# EasyEDA Pro project esp32_phiccamdien.eprj

# Schematic Schematic1
Board Name: Board1; Create Date: 2025-09-16; Page Name: P1; Project Name: esp32_phiccamdien; Schematic Name: Schematic1; Update Date: 2025-10-02; Company: EasyEDA.com; Page Size: A4; Version: V1.0
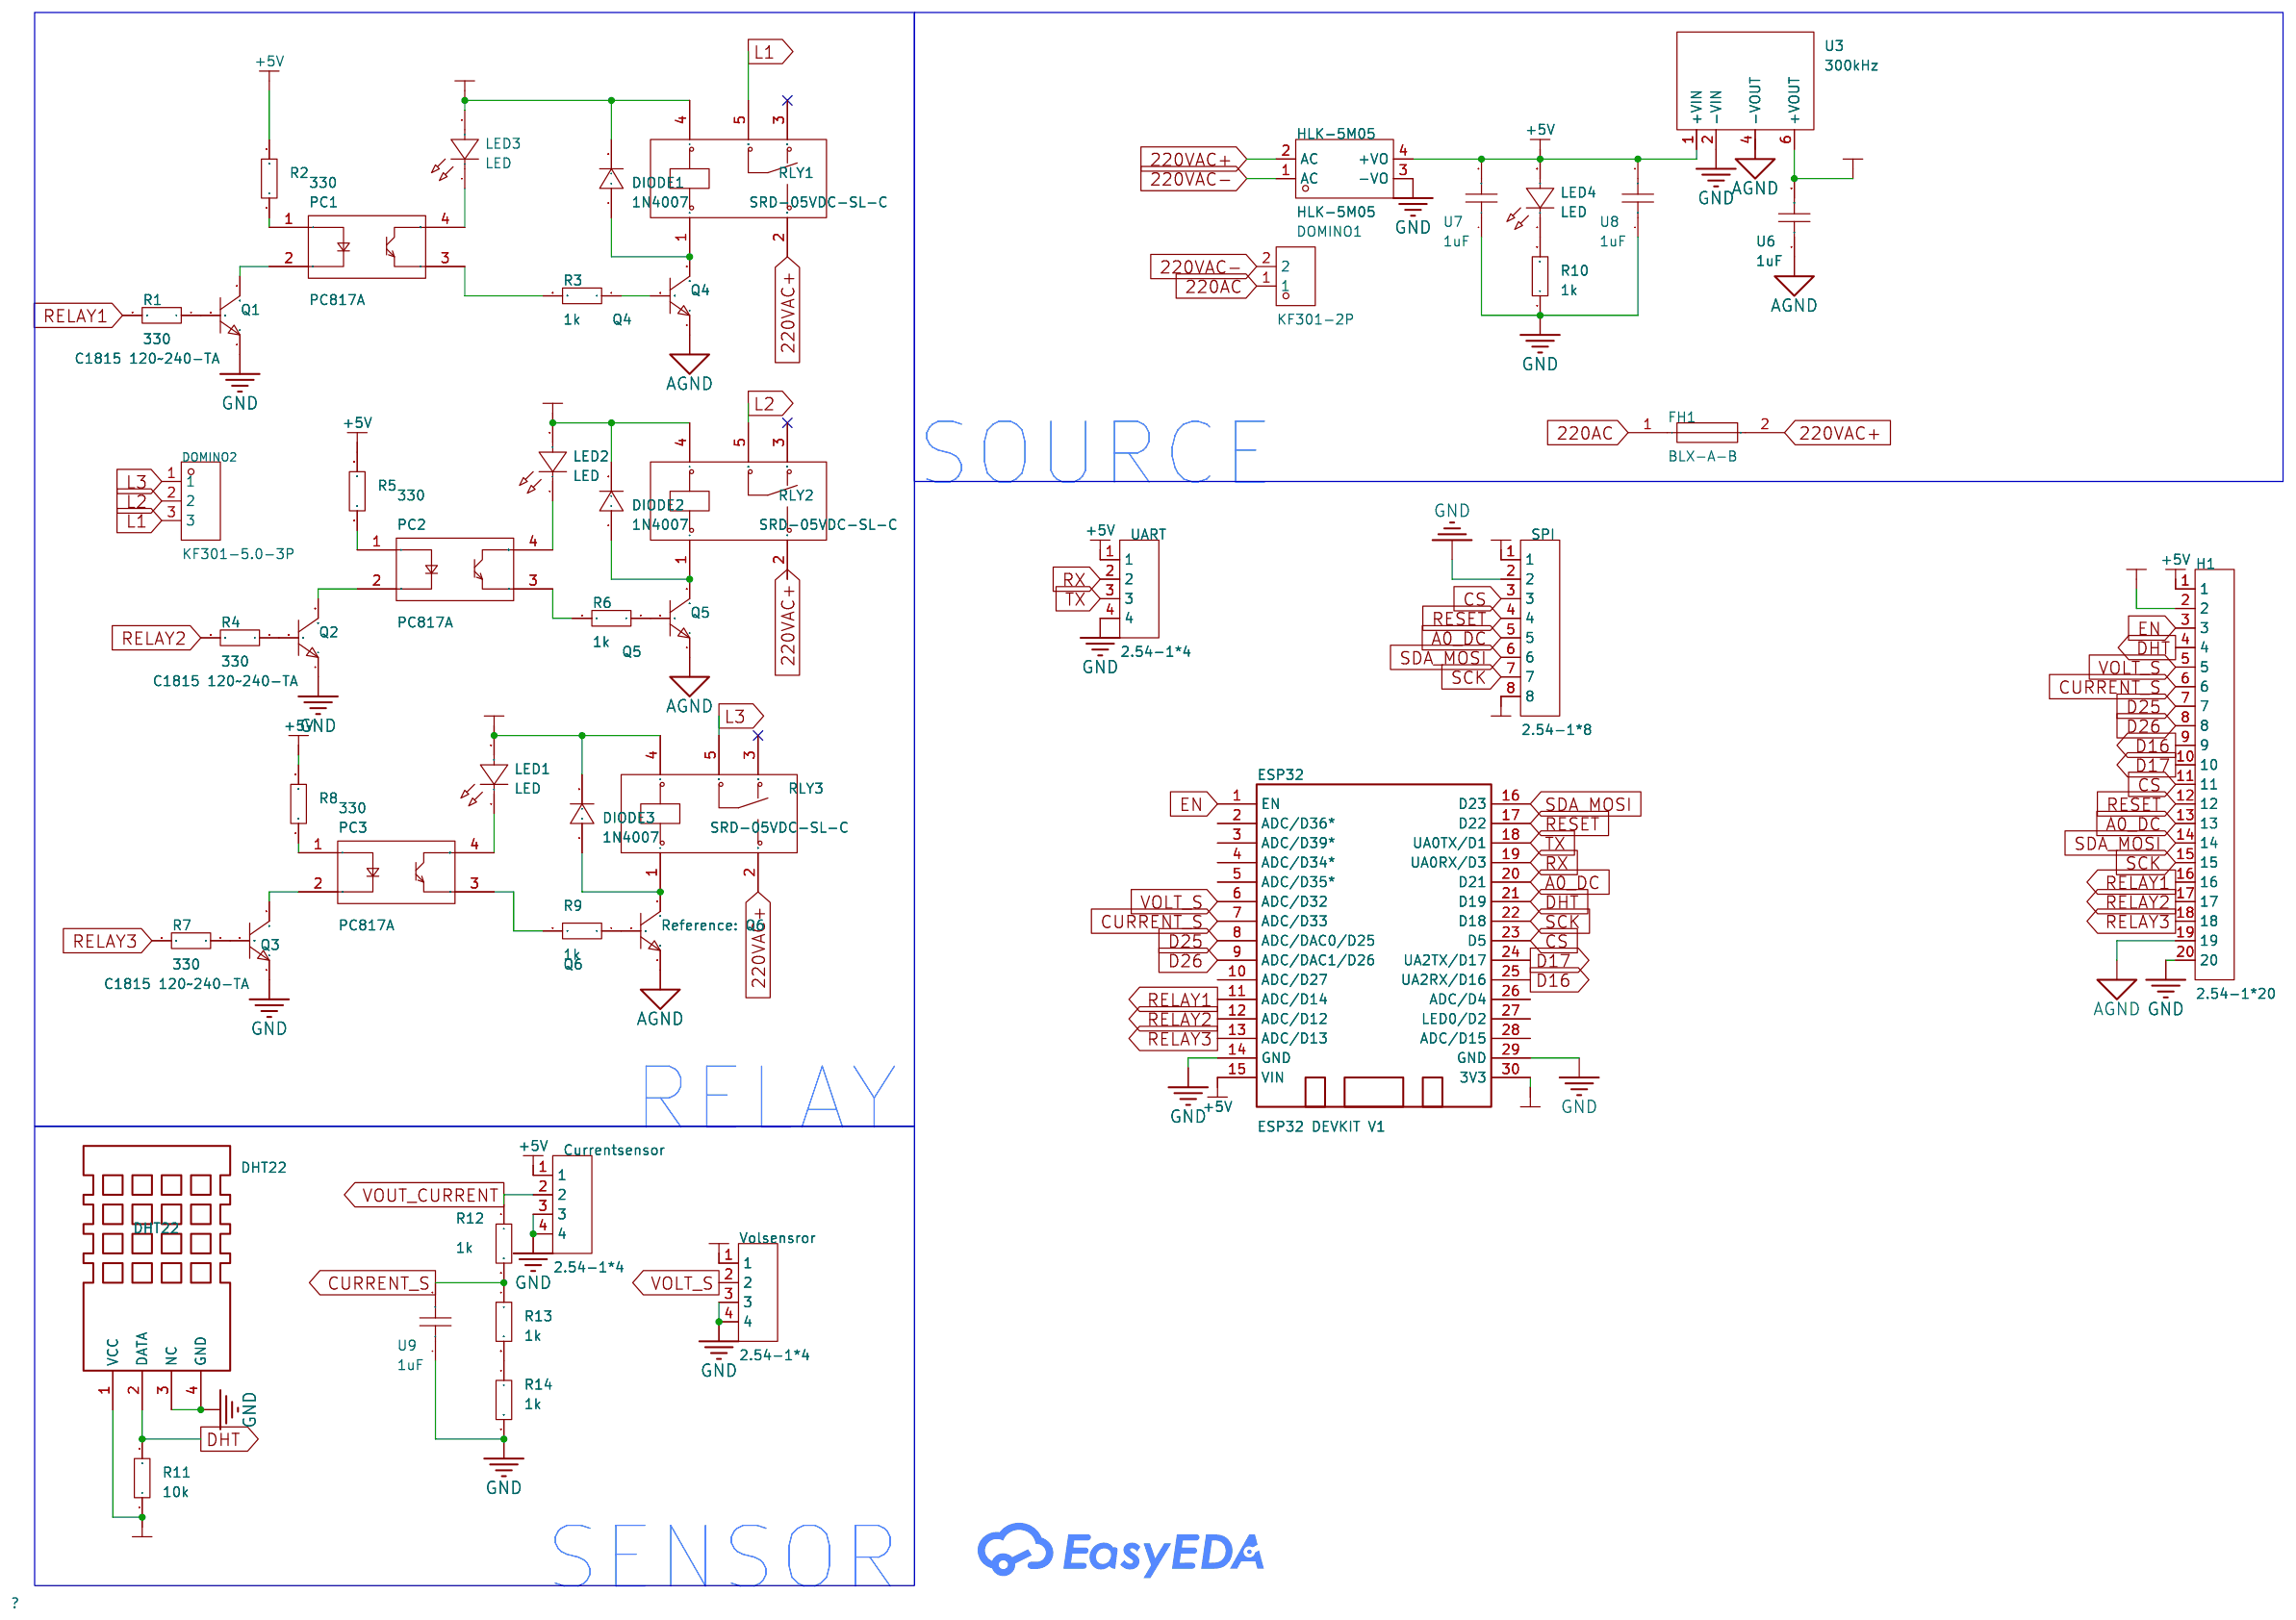
[diagram p0: schematic sheet]

## Parts
Currentsensor  2.54-1*4  [HDR-TH_4P-P2.54-V-M-1]
DHT22  DHT22  [DHT22_AM2303_VERT]
DIODE1  1N4007  [DO-41_BD2.4-L4.7-P8.70-D0.9-FD]
DIODE2  1N4007  [DO-41_BD2.4-L4.7-P8.70-D0.9-FD]
DIODE3  1N4007  [DO-41_BD2.4-L4.7-P8.70-D0.9-FD]
DOMINO1  KF301-2P  [CONN-TH_XY301V-A-5.0-2P]
DOMINO2  KF301-5.0-3P  [CONN-TH_3P-P5.00_KF301-5.0-3P]
ESP32  ESP32 DEVKIT V1  [DOIT-ESP32-DEVKIT-V1]
FH1  BLX-A-B  [FUSE-TH_BLX-A-B]
H1  2.54-1*20  [HDR-TH_20P-P2.54-V-M]
HLK-5M05  HLK-5M05  [PWRM-TH_HLK-5M05]
LED1  LED  [LED0603-RD_RED]
LED2  LED  [LED0603-RD_RED]
LED3  LED  [LED0603-RD_RED]
LED4  LED  [LED0603-RD_RED]
PC1  PC817A  [DIP-4_L4.6-W6.5-P2.54-LS7.6-BL]
PC2  PC817A  [DIP-4_L4.6-W6.5-P2.54-LS7.6-BL]
PC3  PC817A  [DIP-4_L4.6-W6.5-P2.54-LS7.6-BL]
Q1  C1815 120~240-TA  [TO-92-3_L4.9-W3.7-P1.27-L]
Q2  C1815 120~240-TA  [TO-92-3_L4.9-W3.7-P1.27-L]
Q3  C1815 120~240-TA  [TO-92-3_L4.9-W3.7-P1.27-L]
Q4  Q4  [TO-92-3_L4.9-W3.7-P1.27-L]
Q5  Q5  [TO-92-3_L4.9-W3.7-P1.27-L]
Q6  Q6  [TO-92-3_L4.9-W3.7-P1.27-L]
R1  330  [R0603]
R2  330  [R0603]
R3  1k  [R0603]
R4  330  [R0603]
R5  330  [R0603]
R6  1k  [R0603]
R7  330  [R0603]
R8  330  [R0603]
R9  1k  [R0603]
R10  1k  [R0603]
R11  10k  [R0603]
R12  1k  [R0603]
R13  1k  [R0603]
R14  1k  [R0603]
RLY1  SRD-05VDC-SL-C  [RELAY-TH_SRD-XXVDC-XL-C]
RLY2  SRD-05VDC-SL-C  [RELAY-TH_SRD-XXVDC-XL-C]
RLY3  SRD-05VDC-SL-C  [RELAY-TH_SRD-XXVDC-XL-C]
SPI  2.54-1*8  [HDR-TH_8P-P2.54-V-M]
U3  300kHz  [PWRM-TH_4P-L19.5-W7.0-P2.54]
U6  1uF  [C0402]
U7  1uF  [C0402]
U8  1uF  [C0402]
U9  1uF  [C0402]
UART  2.54-1*4  [HDR-TH_4P-P2.54-V-M-1]
Volsensror  2.54-1*4  [HDR-TH_4P-P2.54-V-M-1]

## Library data of the parts
Currentsensor UART Volsensror = 2.54-1*4: LCSC Part Name: 1x4P 间距:2.54mm 方针 直插; Supplier Part: C5116483; Manufacturer: ZHOURI(洲日); Supplier Footprint: 插件,P=2.54mm; JLCPCB Part Class: Extended Part; Datasheet: https://item.szlcsc.com/datasheet/2.54-1*4/5692726.html; Supplier: LCSC; Pin Structure: 1x4P; Pitch: 2.54mm; Circluar Pins/Square Pins: Pin Header; Mounting Type: Through Hole; Number of Rows: 1; Number of Pins: 4P; Current Rating: 2.5A; Length of Mating Pin: 6mm; Insulation Height: 2.54mm; Length of End Connection Pin: 3mm; Contact Material: Brass; Contact Plating: Gold; Operating Temperature: -40℃~+105℃
DHT22 = DHT22: Supplier Part: PRODUCT ID: 385; Supplier: AdaFruit; Voltage: 3.3V - 5.5V; Mounted: Yes; Manufacturer: Aosong (Guangzhou) Electronics Co., Ltd.
DIODE1-DIODE3 = 1N4007_C2978779: Supplier Part: C2978779; Manufacturer: EIC; Supplier Footprint: DO-41; JLCPCB Part Class: Extended Part; Datasheet: https://item.szlcsc.com/datasheet/1N4007/3393604.html; Supplier: LCSC; Voltage - Forward(Vf@If): 1.1V@1A; Voltage - DC Reverse(Vr): 1kV; Current - Rectified: 1A; Reverse Leakage Current (Ir): 5uA@1kV; Operating Junction Temperature Range: -65℃~+175℃
DOMINO1 = KF301-2P接线端子: Supplier Part: C9900016950; Supplier Footprint: CK301-2P; JLCPCB Part Class: Extended Part; Supplier: LCSC; Check: true
DOMINO2 = KF301-5.0-3P: LCSC Part Name: 5mm 1x3P 排数:1 每排P数:3 直插; Supplier Part: C474882; Manufacturer: KEFA(科发); Supplier Footprint: 插件,P=5mm; JLCPCB Part Class: Extended Part; Datasheet: https://atta.szlcsc.com/upload/public/pdf/source/20230317/03A5B5FC229D6F9225E8F51DA1A4E80A.pdf; Supplier: LCSC; Structure: 1x3P; Pitch: 5mm; Color: Blue; Mounting Style: Straight; Current Rating (Max): 17A; Voltage Rating (Max): 250V; Number of Pins: 3P; Number of Rows: 1; Wire Gauge - AWG: 14~22; Wire Gauge - mm2: 1.5; Number of PINs Per Row: 3; Operating Temperature Range: -30℃~+120℃
ESP32 = essssp32
FH1 = BLX-A-B: Supplier Part: C41371862; Manufacturer: XFCN(兴飞); Supplier Footprint: 插件,P=22.3mm; JLCPCB Part Class: Extended Part; Datasheet: https://atta.szlcsc.com/upload/public/pdf/source/20240828/99BD40486647FE73831CA601C884103B.pdf; Supplier: LCSC; Voltage Rating: 500V; Current Rating: 10A
H1 = 2.54-1*20: LCSC Part Name: 1x20P 间距:2.54mm 方针 直插; Supplier Part: C5156618; Manufacturer: ZHOURI(洲日); Supplier Footprint: 插件,P=2.54mm; JLCPCB Part Class: Extended Part; Datasheet: https://item.szlcsc.com/datasheet/2.54-1*20/5790718.html; Supplier: LCSC; Pin Structure: 1x20P; Pitch: 2.54mm; Circluar Pins/Square Pins: Pin Header; Mounting Type: Through Hole; Number of Rows: 1; Number of Pins: 20P; Current Rating: 2.5A; Length of Mating Pin: 6mm; Insulation Height: 2.54mm; Length of End Connection Pin: 3mm; Contact Material: Brass; Contact Plating: Gold; Operating Temperature: -40℃~+105℃
HLK-5M05 = HLK-5M05_C209907: Supplier Part: C209907; Manufacturer: HI-LINK(海凌科); Supplier Footprint: 插件; JLCPCB Part Class: Extended Part; Datasheet: https://atta.szlcsc.com/upload/public/pdf/source/20221201/2BCA712152932936C3B48F57332AB96D.pdf; Supplier: LCSC; Check: true
LED1-LED4 = 贴片LED_C9900008255: LCSC Part Name: 贴片LED; Supplier Part: C9900008255; JLCPCB Part Class: Extended Part; Supplier: LCSC; Check: true
PC1-PC3 = PC817A: LCSC Part Name: 光电晶体管光电耦合器; Supplier Part: C22466619; Manufacturer: GOODWORK(固得沃克); Supplier Footprint: DIP-4; JLCPCB Part Class: Extended Part; Datasheet: https://item.szlcsc.com/datasheet/PC817A/24167544.html; Supplier: LCSC; Input type: DC; Output Type: Phototransistor; Voltage - Forward(Vf): 1.2V; Output Current: 50mA; Isolation Voltage(Vrms): 5kV; Reverse Voltage: 6V; Load Voltage: 35V; Number of Outputs: 1; Vce Saturation(VCE(sat)): 100mV@1mA,20mA; Rise time: 6us@2mA,100Ω; Fall time: 5us@2mA,100Ω; Operating Temperature: -55℃~+110℃; Current Transfer Ratio (CTR) Minimum: 100%; Current Transfer Ratio (CTR) Maximum/Saturation Value: 160%
Q1-Q6 = C1815 120~240-TA: type:NPN Current - Collector(Ic): Collector - Emitter Voltage VCEO: Pd - Power Dissipation:400mW DC Current Gain:120@2mA,6V DC Current Gain:120@2mA,6V Transition frequency(fT):80MHz Current - Collector Cutoff:100nA Vce Saturation(VCE(sat)):250mV Operating; Supplier Part: C382004; Manufacturer: CJ(江苏长电/长晶); Supplier Footprint: TO-92-3; JLCPCB Part Class: Extended Part; Datasheet: https://atta.szlcsc.com/upload/public/pdf/source/20190314/C382004_DBB8C3EBF747F2854139D12BD917B4ED.pdf; Supplier: LCSC; type: NPN; Pd - Power Dissipation: 400mW; DC Current Gain: 120@2mA,6V; Transition frequency(fT): 80MHz; Current - Collector Cutoff: 100nA; Vce Saturation(VCE(sat)): 250mV; Operating Temperature: -55℃~+150℃; Check: true
R1-R14 = Res_0603: Supplier Footprint: 0603; Check: true
RLY1-RLY3 = SRD-05VDC-SL-C: LCSC Part Name: 蓝色 单组转换型继电器; Supplier Part: C35449; Manufacturer: 松乐; Supplier Footprint: 插件,15.6x19.2mm; JLCPCB Part Class: Extended Part; Datasheet: https://item.szlcsc.com/datasheet/SRD-05VDC-SL-C/36422.html; Supplier: LCSC; Coil Voltage: 5V; Contact Form: 1 Form C: 1C (SPDT-CO); Number of Pins: 5; Switching Voltage(Max): 250V@AC; Coil Rated Power: 360mW; Switching Current(Max): 15A; Coil Type: Non-Polarized - Single Coil; Coil Resistance: 70Ω; Contact Resistance: 100mΩ; Operate Time: 10ms; Release Time: 10ms
SPI = 2.54-1*8: LCSC Part Name: 1x8P 间距:2.54mm 方针 直插; Supplier Part: C5156616; Manufacturer: ZHOURI(洲日); Supplier Footprint: 插件,P=2.54mm; JLCPCB Part Class: Extended Part; Datasheet: https://item.szlcsc.com/datasheet/2.54-1*8/5790716.html; Supplier: LCSC; Pin Structure: 1x8P; Pitch: 2.54mm; Circluar Pins/Square Pins: Pin Header; Mounting Type: Through Hole; Number of Rows: 1; Number of Pins: 8P; Current Rating: 2.5A; Length of Mating Pin: 6mm; Insulation Height: 2.54mm; Length of End Connection Pin: 3mm; Contact Material: Brass; Contact Plating: Gold; Operating Temperature: -40℃~+105℃
U3 = B0505S-2W_C22749780: LCSC Part Name: DCDC隔离电源模块; Supplier Part: C22749780; Manufacturer: YLPTEC(易川); Manufacturer Part: B0505S-2W; Supplier Footprint: SIP,19.5x7mm; JLCPCB Part Class: Extended Part; Datasheet: https://item.szlcsc.com/datasheet/B0505S-2W/24474763.html; Supplier: LCSC; Number of Channels: 1; Output Power: 2W; Voltage - Supply: 4.5V~5.5V; Conversion Efficiency: 90%; Output Voltage: 5V; Output Current(Max): 200mA; Capacitive Load(Max): 200uF; Isolation Voltage(Vrms): 1.5kV; Features: Short Circuit Protection; Operating Temperature: -40℃~+85℃; Ripple Noise: 60mVp-p; Length: 19.5mm; Width: 10mm; Height: 7mm
U6-U9 = GRM155R71E103KA01D | SMD Ceramic Capacitor: Supplier Part: C29020409; Supplier Footprint: 0402; Supplier: LCSC; Check: true

## Nets
220VAC+: FH1.2 HLK-5M05.2(AC) RLY1.2 RLY2.2 RLY3.2
220VAC-: DOMINO1.2 HLK-5M05.1(AC)
+3.3V: DHT22.1(VCC) ESP32.30(3V3) H1.2 R11.1 SPI.1 SPI.8 Volsensror.1
+5.0V: DIODE1.2(K) DIODE2.2(K) DIODE3.2(K) LED1.2(A) LED2.2(A) LED3.2(A) RLY1.4 RLY2.4 RLY3.4 U3.6(+VOUT) U6.2
+5V: Currentsensor.1 ESP32.15(VIN) H1.1 HLK-5M05.4(+VO) LED4.2(A) R2.2 R5.2 R8.2 U3.1(+VIN) U7.2 U8.2 UART.1
AGND: H1.19 Q4.1(E) Q5.1(E) Q6.1(E) U3.4(-VOUT) U6.1
GND: Currentsensor.3 Currentsensor.4 DHT22.3(NC) DHT22.4(GND) ESP32.14(GND) ESP32.29(GND) H1.20 HLK-5M05.3(-VO) Q1.1(E) Q2.1(E) Q3.1(E) R10.1 R14.2 SPI.2 U3.2(-VIN) U7.1 U8.1 U9.1 UART.4 Volsensror.3 Volsensror.4
220AC: DOMINO1.1 FH1.1
A0_DC: ESP32.20(D21) H1.13 SPI.5
CS: ESP32.23(D5) H1.11 SPI.3
CURRENT_S: ESP32.7(ADC/D33) H1.6 R12.2 R13.1 U9.2
D16: ESP32.25(UA2RX/D16) H1.9
D17: ESP32.24(UA2TX/D17) H1.10
D25: ESP32.8(ADC/DAC0/D25) H1.7
D26: ESP32.9(ADC/DAC1/D26) H1.8
DHT: DHT22.2(DATA) ESP32.21(D19) H1.4 R11.2
EN: ESP32.1(EN) H1.3
L1: DOMINO2.3 RLY1.5
L2: DOMINO2.2 RLY2.5
L3: DOMINO2.1 RLY3.5
RELAY1: ESP32.11(ADC/D14) H1.16 R1.2
RELAY2: ESP32.12(ADC/D12) H1.17 R4.2
RELAY3: ESP32.13(ADC/D13) H1.18 R7.2
RESET: ESP32.17(D22) H1.12 SPI.4
RX: ESP32.19(UA0RX/D3) UART.2
SCK: ESP32.22(D18) H1.15 SPI.7
SDA_MOSI: ESP32.16(D23) H1.14 SPI.6
TX: ESP32.18(UA0TX/D1) UART.3
VOLT_S: ESP32.6(ADC/D32) H1.5 Volsensror.2
VOUT_CURRENT: Currentsensor.2 R12.1
$1N1884: Q5.3(B) R6.1
$1N2058: DIODE2.1(A) Q5.2(C) RLY2.1
$1N2411: PC2.2(C) Q2.2(C)
$1N2413: Q2.3(B) R4.1
$1N2414: PC2.1(A) R5.1
$1N2420: PC2.3(EM) R6.2
$1N2880: Q6.3(B) R9.1
$1N2883: DIODE3.1(A) Q6.2(C) RLY3.1
$1N2886: PC3.2(C) Q3.2(C)
$1N2895: Q3.3(B) R7.1
$1N2896: PC3.1(A) R8.1
$1N2898: PC3.3(EM) R9.2
$1N3237: Q4.3(B) R3.1
$1N3240: DIODE1.1(A) Q4.2(C) RLY1.1
$1N3243: PC1.2(C) Q1.2(C)
$1N3252: Q1.3(B) R1.1
$1N3253: PC1.1(A) R2.1
$1N3255: PC1.3(EM) R3.2
$1N8641: LED1.1(K) PC3.4(COL)
$1N8709: LED2.1(K) PC2.4(COL)
$1N8745: LED3.1(K) PC1.4(COL)
$1N8803: LED4.1(K) R10.2
$1N15345: R13.2 R14.1

Not connected (* = marked no-connect by the designer): ESP32 2(ADC/D36*) 3(ADC/D39*) 4(ADC/D34*) 5(ADC/D35*) 10(ADC/D27) 26(ADC/D4) 27(LED0/D2) 28(ADC/D15); RLY1 3*; RLY2 3*; RLY3 3*

## Notes on the sheet
- SOURCE
- RELAY
- SENSOR

# Board PCB1
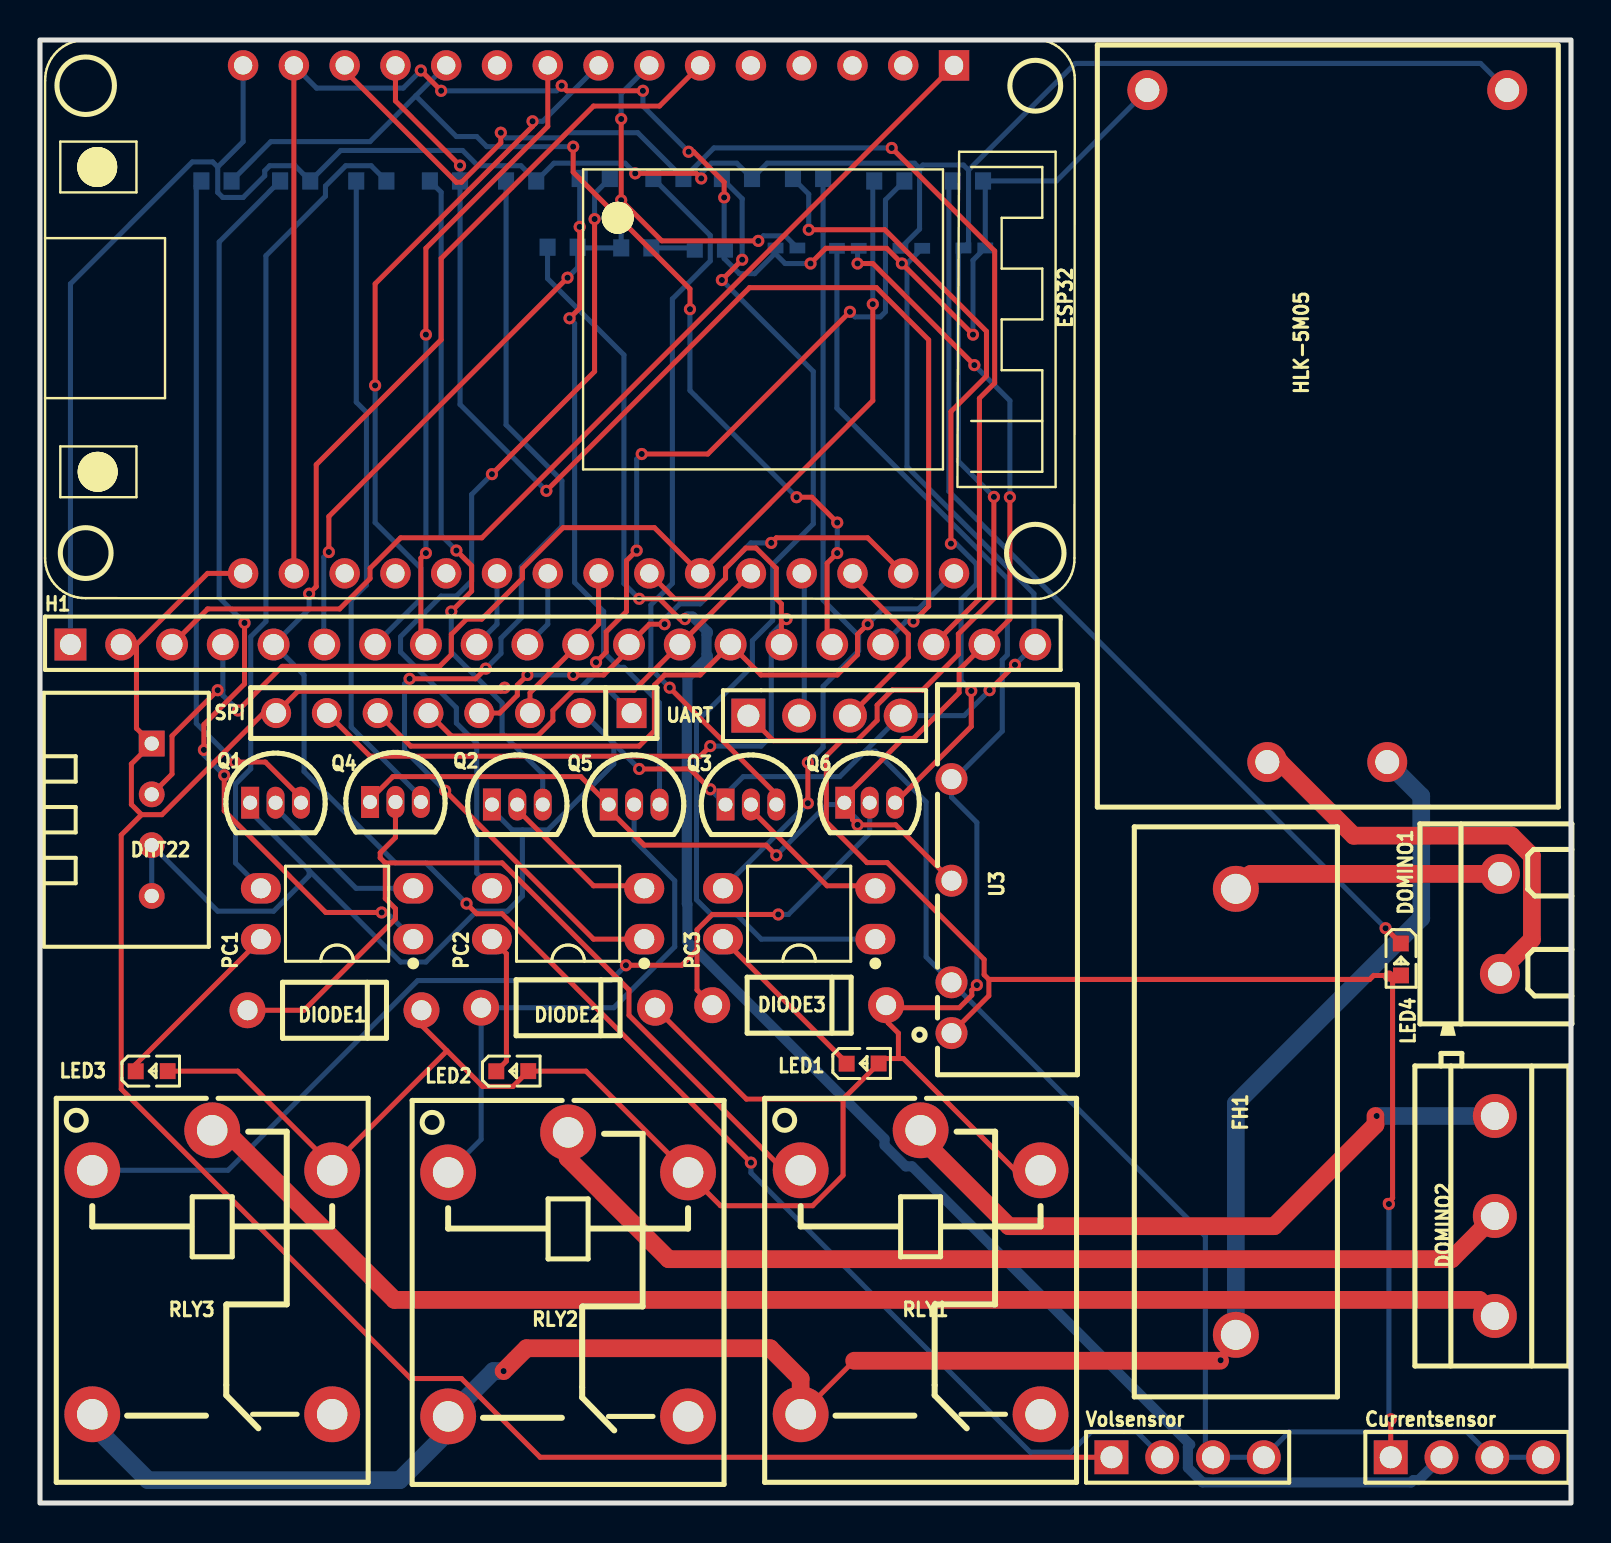
[diagram p1: board, top side]
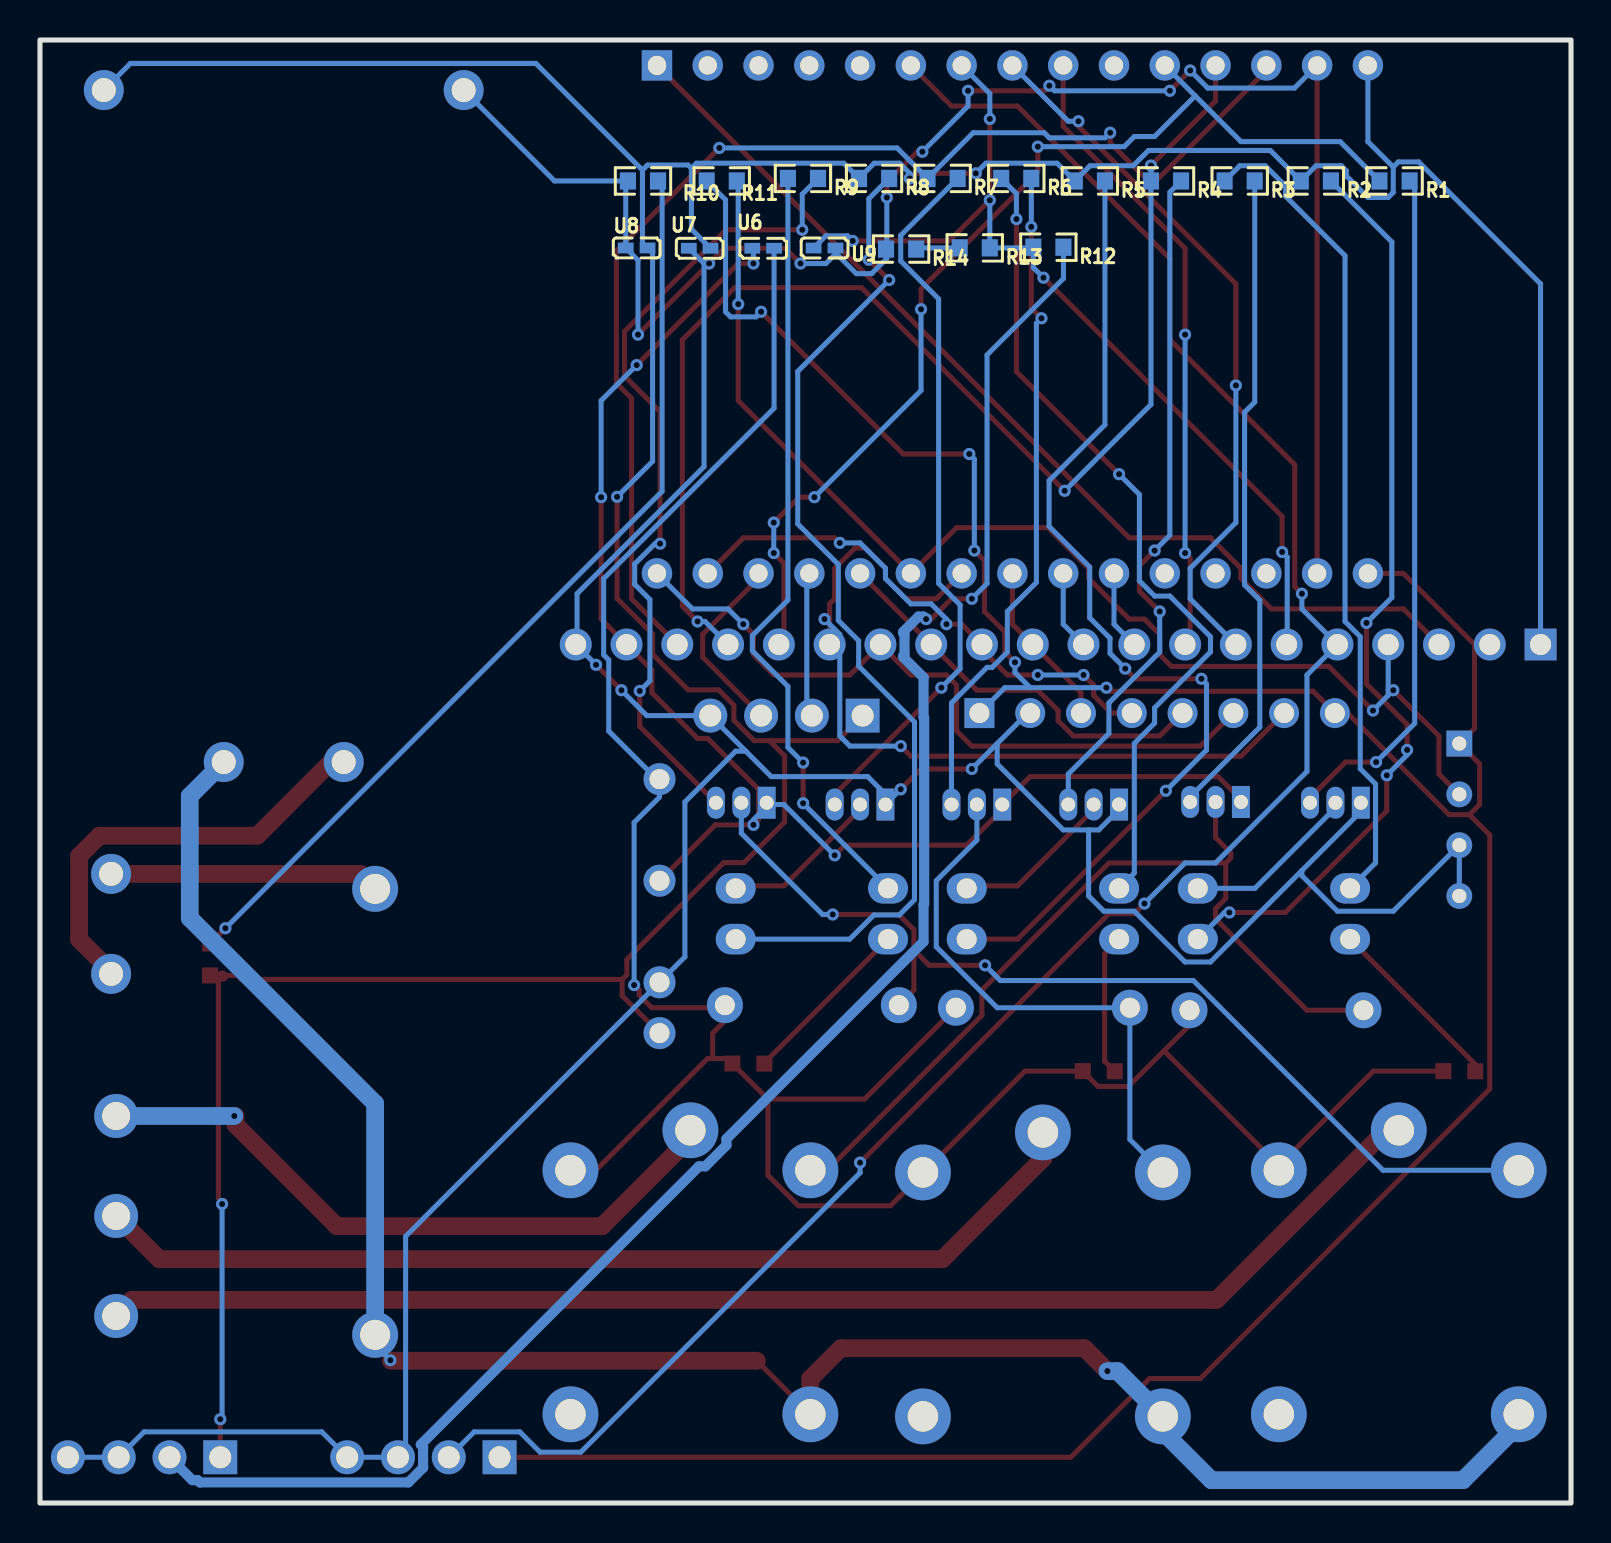
[diagram p2: board, bottom side, seen from below]

Outline 76.58 x 73.15 mm; copper layers: Top Layer, Bottom Layer. Coordinates in mm from the lower left corner of the outline.
Outline path: rectangle 0,73.15 76.58,0
Stack: Top Layer 0.035mm / Dielectric1 1.51mm FR4 er 4.5 / Bottom Layer 0.035mm

## Design rules (mm)
template: JLCPCB Capability(Two Layers Board)
spacing copperThickness1oz (default): track to track 0.102, other pairs 0.152 to 0.3
spacing copperThickness2oz: track to track 0.203, other pairs 0.152 to 0.3
track width copperThickness1oz (default): min 0.127, default 0.254, max 2.54
track width copperThickness2oz: min 0.203, default 0.254, max 2.54
differential pair differentialPair (default): width min 0.127, default 0.254, max 2.54; gap min 0.152, default 0.152
via viaSize (default): diameter min 0.5, default 0.61, max 10; hole min 0.3, default 0.305, max 6.3

## Placement (name value [footprint] x y rotation side)
Currentsensor  2.54-1*4  [HDR-TH_4P-P2.54-V-M-1]  71.37 2.29 0 top
DHT22  DHT22  [DHT22_AM2303_VERT]  5.59 34.16 180 top
DIODE1  1N4007  [DO-41_BD2.4-L4.7-P8.70-D0.9-FD]  14.73 24.64 0 top
DIODE2  1N4007  [DO-41_BD2.4-L4.7-P8.70-D0.9-FD]  26.42 24.77 0 top
DIODE3  1N4007  [DO-41_BD2.4-L4.7-P8.70-D0.9-FD]  37.97 24.89 0 top
DOMINO1  KF301-2P  [CONN-TH_XY301V-A-5.0-2P]  73.03 28.96 270 top
DOMINO2  KF301-5.0-3P  [CONN-TH_3P-P5.00_KF301-5.0-3P]  72.77 14.35 90 top
ESP32  ESP32 DEVKIT V1  [DOIT-ESP32-DEVKIT-V1]  45.72 71.88 270 top
FH1  BLX-A-B  [FUSE-TH_BLX-A-B]  59.82 19.56 270 top
H1  2.54-1*20  [HDR-TH_20P-P2.54-V-M]  25.65 42.93 0 top
HLK-5M05  HLK-5M05  [PWRM-TH_HLK-5M05]  64.39 53.85 90 top
LED1  LED  [LED0603-RD_RED]  41.15 21.97 0 top
LED2  LED  [LED0603-RD_RED]  23.62 21.59 0 top
LED3  LED  [LED0603-RD_RED]  5.59 21.59 0 top
LED4  LED  [LED0603-RD_RED]  68.07 27.18 270 top
PC1  PC817A  [DIP-4_L4.6-W6.5-P2.54-LS7.6-BL]  14.86 29.46 90 top
PC2  PC817A  [DIP-4_L4.6-W6.5-P2.54-LS7.6-BL]  26.42 29.46 90 top
PC3  PC817A  [DIP-4_L4.6-W6.5-P2.54-LS7.6-BL]  37.97 29.46 90 top
Q1  C1815 120~240-TA  [TO-92-3_L4.9-W3.7-P1.27-L]  11.78 35.02 0 top
Q2  C1815 120~240-TA  [TO-92-3_L4.9-W3.7-P1.27-L]  23.88 34.93 0 top
Q3  C1815 120~240-TA  [TO-92-3_L4.9-W3.7-P1.27-L]  35.56 34.93 0 top
Q4  Q4  [TO-92-3_L4.9-W3.7-P1.27-L]  17.78 35.05 0 top
Q5  Q5  [TO-92-3_L4.9-W3.7-P1.27-L]  29.72 34.93 0 top
Q6  Q6  [TO-92-3_L4.9-W3.7-P1.27-L]  41.5 35.02 0 top
R1  330  [R0603]  8.83 66.1 0 bottom
R2  330  [R0603]  12.76 66.1 0 bottom
R3  1k  [R0603]  16.57 66.1 0 bottom
R4  330  [R0603]  20.26 66.1 0 bottom
R5  330  [R0603]  24.07 66.1 0 bottom
R6  1k  [R0603]  27.75 66.23 0 bottom
R7  330  [R0603]  31.43 66.23 0 bottom
R8  330  [R0603]  34.86 66.23 0 bottom
R9  1k  [R0603]  38.42 66.23 0 bottom
R10  1k  [R0603]  46.42 66.1 180 bottom
R11  10k  [R0603]  42.48 66.1 180 bottom
R12  1k  [R0603]  26.14 62.79 0 bottom
R13  1k  [R0603]  29.82 62.76 0 bottom
R14  1k  [R0603]  33.51 62.7 0 bottom
RLY1  SRD-05VDC-SL-C  [RELAY-TH_SRD-XXVDC-XL-C]  44.05 11.54 270 top
RLY2  SRD-05VDC-SL-C  [RELAY-TH_SRD-XXVDC-XL-C]  26.42 11.43 270 top
RLY3  SRD-05VDC-SL-C  [RELAY-TH_SRD-XXVDC-XL-C]  8.61 11.54 270 top
SPI  2.54-1*8  [HDR-TH_8P-P2.54-V-M]  20.7 39.5 180 top
U3  300kHz  [PWRM-TH_4P-L19.5-W7.0-P2.54]  45.59 29.85 90 top
U6  1uF  [C0402]  40.41 62.74 180 bottom
U7  1uF  [C0402]  43.58 62.74 180 bottom
U8  1uF  [C0402]  46.74 62.76 180 bottom
U9  1uF  [C0402]  37.34 62.75 0 bottom
UART  2.54-1*4  [HDR-TH_4P-P2.54-V-M-1]  39.24 39.37 0 top
Volsensror  2.54-1*4  [HDR-TH_4P-P2.54-V-M-1]  57.4 2.29 0 top

## Footprints (pads in the part's own frame, mm; a bottom-side part is the same pattern mirrored in y, then rotated)
C0402
  rect 0.79x0.54 smd: 1(-0.545,0) 2(0.545,0)
CONN-TH_3P-P5.00_KF301-5.0-3P
  round 2.2 hole 1.4: 1(-5,0) 2(0,0) 3(5,0)
CONN-TH_XY301V-A-5.0-2P
  round 2 hole 1.2: 1(-2.5,0) 2(2.5,0)
DHT22_AM2303_VERT
  rect 1.296x1.296 hole 0.711: 1(0,-3.81)
  round 1.296 hole 0.711: 2(0,-1.27) 3(0,1.27) 4(0,3.81)
DIP-4_L4.6-W6.5-P2.54-LS7.6-BL
  oval 1.524x2 hole 1: 1(-1.27,-3.81) 2(1.27,-3.81) 3(1.27,3.81) 4(-1.27,3.81)
DO-41_BD2.4-L4.7-P8.70-D0.9-FD
  round 1.8 hole 1: 1(-4.35,0) 2(4.35,0)
DOIT-ESP32-DEVKIT-V1
  rect 1.524x1.524 hole 0.96x0.914: 1(0,0)
  round 1.524 hole 0.914: 2(0,-2.54) 3(0,-5.08) 4(0,-7.62) 5(0,-10.16) 6(0,-12.7) 7(0,-15.24) 8(0,-17.78) 9(0,-20.32) 10(0,-22.86) 11(0,-25.4) 12(0,-27.94) 13(0,-30.48) 14(0,-33.02) 15(0,-35.56) 16(25.4,0) 17(25.4,-2.54) 18(25.4,-5.08) 19(25.4,-7.62) 20(25.4,-10.16) 21(25.4,-12.7) 22(25.4,-15.24) 23(25.4,-17.78) 24(25.4,-20.32) 25(25.4,-22.86) 26(25.4,-25.4) 27(25.4,-27.94) 28(25.4,-30.48) 29(25.4,-33.02) 30(25.4,-35.56)
FUSE-TH_BLX-A-B
  round 2.3 hole 1.5: 1(-11.15,0) 2(11.15,0)
HDR-TH_4P-P2.54-V-M-1
  rect 1.7x1.7 hole 1.1: 1(-3.81,0)
  round 1.7 hole 1.1: 2(-1.27,0) 3(1.27,0) 4(3.81,0)
HDR-TH_8P-P2.54-V-M
  rect 1.5x1.5 hole 1: 1(-8.89,0)
  round 1.5 hole 1: 2(-6.35,0) 3(-3.81,0) 4(-1.27,0) 5(1.27,0) 6(3.81,0) 7(6.35,0) 8(8.89,0)
HDR-TH_20P-P2.54-V-M
  rect 1.6x1.6 hole 1.05: 1(-24.13,0)
  round 1.6 hole 1.05: 2(-21.59,0) 3(-19.05,0) 4(-16.51,0) 5(-13.97,0) 6(-11.43,0) 7(-8.89,0) 8(-6.35,0) 9(-3.81,0) 10(-1.27,0) 11(1.27,0) 12(3.81,0) 13(6.35,0) 14(8.89,0) 15(11.43,0) 16(13.97,0) 17(16.51,0) 18(19.05,0) 19(21.59,0) 20(24.13,0)
LED0603-RD_RED
  rect 0.8x0.8 smd: 1(-0.799,-0.004) 2(0.799,0.004)
PWRM-TH_4P-L19.5-W7.0-P2.54
  round 1.6 hole 1: 1(-6.35,0) 2(-3.81,0) 4(1.27,0) 6(6.35,0)
PWRM-TH_HLK-5M05
  round 2 hole 1.2: 1(-16.8,3) 2(-16.8,-3) 3(16.8,9) 4(16.8,-9)
R0603
  rect 0.806x0.864 smd: 1(-0.753,0) 2(0.753,0)
RELAY-TH_SRD-XXVDC-XL-C
  round 2.794 hole 1.524: 1(-5.1,-6) 2(7.1,-6) 3(7.1,6) 4(-5.1,6) 5(-7.1,0)
TO-92-3_L4.9-W3.7-P1.27-L
  rect 0.9x1.6 hole 0.7: 1(-1.27,0)
  oval 0.9x1.6 hole 0.7: 2(0,0) 3(1.27,0)

## Nets
As in the schematic.

Pads without a net: ESP32 2 3 4 5 10 26 27 28; RLY1 3; RLY2 3; RLY3 3

## Via types
v1: diameter 0.61, hole 0.305, Top Layer to Bottom Layer, 91 vias

## Routing (per net, layer and track width the routed paths; a pad name or vN(x,y) marks a point on that pad's centre or on a via; arc(x,y) is an arc through that point)
220VAC+: length 99.4
  Top Layer w0.254: v1(59.06,7.14) 59.03,7.11 ; 40.72,7.11 RLY1.2
  Top Layer w0.889: v1(23.19,6.59) 24.33,7.74 36.52,7.74 38.05,6.21 RLY1.2 ; 59.03,7.11 40.72,7.11
  Bottom Layer w0.254: FH1.2 59.82,7.9 v1(59.06,7.14)
  Bottom Layer w0.889: FH1.2 59.82,19.98 69.09,29.25 69.09,35.35 67.39,37.05 ; 20.52,4.44 22.68,6.59 v1(23.19,6.59) ; RLY3.2 2.62,3.93 5.4,1.14 17.99,1.14 20.4,3.55 20.4,4.31
220VAC-: length 21.7
  Top Layer w0.889: DOMINO1.2 73.03,26.58 74.62,28.18 74.62,32.35 73.61,33.37 65.71,33.37 62.02,37.05 61.39,37.05
+3.3V: length 151.2
  Top Layer w0.254: ESP32.30 8.38,46.48 4.83,42.93 ; v1(23.24,40.77) 23.06,40.59 12.9,40.59 SPI.8 11.18,39.5 6.1,34.42 5.08,34.42 ; 5.08,34.42 4.06,33.4 4.06,20.7 18.54,6.22 21.08,6.22 25.02,2.29 Volsensror.1 ; 5.08,34.42 4.57,34.93 4.57,36.96 DHT22.1 4.83,38.73 4.83,42.93 ; v1(30.1,52.45) 33.4,52.45 v1(40.51,59.56) ; v1(27.81,42.04) 28.32,42.55 28.32,43.56 29.34,44.58 29.34,47.12 v1(29.84,47.62) ; 4.83,42.93 H1.2
  Bottom Layer w0.254: v1(23.24,40.77) 27.05,40.77 ; 27.05,40.77 28.32,40.77 SPI.1 ; 27.05,40.77 27.81,41.53 v1(27.81,42.04) ; v1(40.51,59.56) 40.77,59.31 42.04,59.31 42.29,59.56 42.29,65.16 R11.1 ; v1(30.1,52.45) 29.84,52.2 v1(29.84,47.62)
+5.0V: length 123.7
  Top Layer w0.254: RLY1.4 48.78,16.64 43.19,22.22 42.94,22.22 ; 20.36,22.61 14.61,16.87 ; 20.36,22.61 22.14,20.83 23.66,20.83 LED2.2 27.31,21.59 32.4,16.51 34.04,14.86 38.65,14.86 40.17,16.39 40.17,20.2 ; 20.36,22.61 19.08,23.89 DIODE1.2 ; 14.61,16.87 9.89,21.59 LED3.2 ; 14.61,16.87 RLY3.4 ; 42.94,22.22 42.94,23.49 42.43,24 42.43,24.76 ; 42.94,22.22 42.2,22.22 LED1.2 40.17,20.2 ; v1(46.86,25.9) 46.61,25.64 46.61,25.39 45.98,24.76 42.43,24.76 ; 42.43,24.76 DIODE3.2 ; 40.17,20.2 35.33,20.2 DIODE2.2
  Bottom Layer w0.254: 45.59,36.06 45.59,35.3 46.86,34.03 v1(46.86,25.9) ; 45.59,36.06 48.13,38.6 48.13,42.15 48.39,42.41 48.39,46.22 39.86,54.74 U6.2 ; 45.59,36.06 U3.6
+5V: length 215
  Top Layer w0.254: 40.09,38.12 39.33,37.36 39.33,34.05 41.37,32.02 42.38,32.02 47.22,27.18 47.22,26.42 47.46,26.18 ; 40.09,38.12 36.69,38.12 UART.1 ; 40.09,38.12 40.86,38.12 41.87,39.13 41.87,39.9 42.63,40.66 44.16,40.66 45.94,42.44 45.94,43.45 47.72,45.23 v1(47.72,50.31) ; LED4.2 66.71,26.38 66.51,26.18 47.46,26.18 ; 47.46,26.18 47.46,25.36 U3.1 ; v1(67.56,4.19) Currentsensor.1 ; v1(29.77,66.48) 32.82,66.48 v1(33.07,66.23) ; 67.42,26.32 67.66,26.08 67.66,15.24 67.42,15
  Top Layer w0.508: 67.47,26.38 67.42,26.32 ; 67.42,15 v1(67.47,14.95)
  Bottom Layer w0.254: 8.89,66.8 8.89,65.53 9.14,65.28 10.16,65.28 11.24,66.36 11.24,66.61 11.49,66.87 12.75,66.87 R2.2 15.04,67.63 21.14,67.63 21.9,66.87 24.06,66.87 R5.2 25.71,66.99 29.26,66.99 v1(29.77,66.48) ; 8.89,66.8 8.64,67.06 7.62,67.06 1.52,60.96 H1.1 ; 8.89,66.8 10.16,68.07 ESP32.15 ; 46.44,66.65 51.78,71.98 72.06,71.98 HLK-5M05.4 ; 46.44,66.65 46.19,66.9 44.16,66.9 44,66.74 ; 46.44,66.65 46.44,63.01 U8.2 45.94,62.5 45.94,52.09 v1(47.72,50.31) ; 44,66.74 43.74,66.99 36.38,66.99 R8.2 34.85,66.99 33.58,66.99 33.07,66.48 v1(33.07,66.23) ; 44,66.74 44,63.7 U7.2 ; v1(67.56,4.19) 67.47,4.28 v1(67.47,14.95)
AGND: length 70.5
  Top Layer w0.254: Q4.1 16.51,35.18 17.65,36.32 27.05,36.32 Q5.1 28.45,34.67 30.23,32.89 36.32,32.89 v1(36.83,32.39) ; v1(48.51,50.29) 48.51,44.2 H1.19 45.97,41.66 45.97,40.51 43.69,38.23 43.18,38.23 40.64,35.69 40.64,34.16 v1(40.89,33.91) 42.8,33.91 U3.4 ; v1(40.89,61.98) 41.66,61.98 v1(46.74,56.9)
  Bottom Layer w0.254: v1(40.89,61.98) 40.89,62.68 U6.1 ; 40.13,34.93 39.37,34.93 v1(36.83,32.39) ; 40.13,34.93 Q6.1 ; 40.13,34.93 40.89,34.16 v1(40.89,33.91) ; v1(48.51,50.29) 48.51,55.12 v1(46.74,56.9)
GND: length 243.9
  Top Layer w0.254: v1(48.77,41.91) v1(47.5,40.64) ; v1(29.97,36.7) 32.51,36.7 v1(33.53,35.69) ; v1(34.22,65.28) 34.22,66.04 32.7,67.56 v1(32.44,67.56) ; v1(38.54,61.98) 39.3,62.74 42.35,62.74 v1(43.11,61.98) v1(46.67,58.42) ; v1(26.09,70.87) 26.35,70.61 v1(30.16,70.61) ; v1(19.05,71.63) v1(20.07,70.61) ; ESP32.14 ESP32.29
  Bottom Layer w0.254: 41.28,37.59 UART.4 46.23,39.37 v1(47.5,40.64) ; 41.28,37.59 40,36.32 35.18,36.32 34.29,35.43 Q3.1 v1(33.53,35.69) ; 41.28,37.59 41.78,37.59 44.32,35.05 44.32,27.31 U3.2 58.29,13.34 58.29,2.67 Volsensror.3 Volsensror.4 62.48,3.56 71.37,3.56 Currentsensor.3 Currentsensor.4 ; 43.37,61.98 U7.1 ; 43.37,61.98 43.37,51.82 49.72,45.47 49.72,42.99 H1.20 v1(48.77,41.91) ; 43.37,61.98 v1(43.11,61.98) ; v1(30.16,70.61) 30.16,69.85 v1(32.44,67.56) ; ESP32.14 13.83,70.75 18.17,70.75 v1(19.05,71.63) ; 24.13,33.66 24.13,30.35 23.37,29.59 21.84,29.59 19.3,27.05 18.03,27.05 13.46,31.62 ; 24.13,33.66 23.62,33.66 22.61,34.67 Q2.1 ; 24.13,33.66 25.4,33.66 28.7,36.96 28.7,37.97 ; v1(46.67,58.42) 46.67,62.14 U8.1 47.28,65.99 R10.1 50.84,66.1 HLK-5M05.3 ; v1(38.54,61.98) 37.27,61.98 36.76,62.48 ; 36.76,62.48 36.76,62.72 U9.1 ; 36.76,62.48 35.75,61.47 34.98,61.47 34.22,62.23 34.22,62.74 ; v1(34.22,65.28) 34.22,62.74 ; 34.22,62.74 R14.2 ; v1(20.07,70.61) 25.84,70.61 v1(26.09,70.87) ; Q1.1 10.51,34.57 13.46,31.62 ; v1(29.97,36.7) 28.7,37.97 ; 28.7,37.97 27.18,39.5 SPI.2 ; 13.46,31.62 13.46,31.37 11.68,29.59 8.89,29.59 DHT22.3 DHT22.4
220AC: length 13.5
  Top Layer w0.889: FH1.1 60.56,31.46 DOMINO1.1
A0_DC: length 20.3
  Top Layer w0.254: 19.43,39.5 20.57,38.35 24.89,38.35 25.65,39.12 25.65,39.62 26.67,40.64 29.72,40.64 H1.13 ESP32.20
CS: length 8.4
  Top Layer w0.254: SPI.3 24.51,40.51 H1.11 27.94,43.94 ESP32.23
CURRENT_S: length 47
  Top Layer w0.254: v1(35.93,63.11) 31.1,63.11 v1(29.07,65.14) v1(29.07,69.2) ; v1(14.45,47.55) 14.45,49.33 v1(26.39,61.27)
  Bottom Layer w0.254: H1.6 14.2,43.23 14.2,47.3 v1(14.45,47.55) ; ESP32.7 29.07,70.47 v1(29.07,69.2) ; v1(29.07,65.14) R13.1 26.93,62.76 R12.2 26.9,61.77 v1(26.39,61.27) ; 37.88,62.75 37.27,63.36 36.18,63.36 v1(35.93,63.11)
D16: length 4
  Bottom Layer w0.254: H1.9 22.86,43.94 ESP32.25
D17: length 4
  Bottom Layer w0.254: H1.10 25.4,43.94 ESP32.24
D25: length 35.8
  Top Layer w0.254: v1(16.76,55.88) 16.76,60.96 24.64,68.83 v1(24.64,69.09)
  Bottom Layer w0.254: v1(24.64,69.09) 25.15,69.09 ESP32.8 ; v1(16.76,55.88) 16.76,49.02 19.05,46.74 19.05,45.21 H1.7
D26: length 31.7
  Top Layer w0.254: v1(19.3,58.42) 19.3,62.74 25.4,68.83 ESP32.9 ; H1.8 19.05,43.18 19.05,47.24 v1(19.3,47.5)
  Bottom Layer w0.254: v1(19.3,58.42) v1(19.3,47.5)
DHT: length 62.4
  Top Layer w0.254: v1(8.89,40.64) 6.6,38.35 6.6,36.45 DHT22.2 ; v1(9.91,39.62) 12.12,41.83 19.99,41.83 20.57,42.42 20.57,43.43 21.34,44.2 22.1,44.2 24.13,46.23 24.13,46.74 26.16,48.77 30.73,48.77 ESP32.21 41.66,55.12 v1(41.66,59.94)
  Bottom Layer w0.254: v1(41.66,59.94) 41.66,66.03 R11.2 ; 9.14,40.64 v1(8.89,40.64) ; 9.14,40.64 9.14,40.39 v1(9.91,39.62) ; 9.14,40.64 H1.4
EN: length 51.4
  Top Layer w0.254: ESP32.1 22.1,48.26 18.03,48.26 16.51,46.74 16.51,46.23 14.99,44.7 8.38,44.7 H1.3
L1: length 33.4
  Top Layer w0.889: 66.8,19.35 66.8,18.91 61.73,13.84 48.46,13.84 44.05,18.26 RLY1.5
  Bottom Layer w0.889: v1(66.86,19.35) DOMINO2.3
L2: length 50.6
  Top Layer w0.889: DOMINO2.2 70.61,12.19 31.44,12.19 26.4,17.24 26.4,18.51
L3: length 68
  Top Layer w0.889: DOMINO2.1 72.77,9.38 72,10.15 17.73,10.15 9.25,18.64 RLY3.5
RELAY1: length 53.2
  Top Layer w0.254: v1(37.85,50.29) 38.61,50.29 v1(39.88,49.02) ; v1(26.67,67.82) 26.67,66.55 32.51,60.71 v1(32.51,59.69) ; H1.16 39.37,43.18 39.37,46.99 v1(39.88,47.5)
  Bottom Layer w0.254: ESP32.11 18.8,70.36 ; 18.8,70.36 16.51,68.07 11.55,68.07 R1.2 ; 18.8,70.36 20.83,68.33 21.84,68.33 22.35,67.82 v1(26.67,67.82) ; v1(37.85,50.29) 32.51,55.63 v1(32.51,59.69) ; v1(39.88,49.02) v1(39.88,47.5)
RELAY2: length 65.2
  Top Layer w0.254: v1(25.33,50.61) 35.49,60.77 41.84,60.77 44.45,58.16 44.45,44.84 v1(43.69,44.08) ; ESP32.12 17.78,70.1 v1(21.01,66.87)
  Bottom Layer w0.254: v1(21.01,66.87) R4.2 21.01,54.93 v1(25.33,50.61) ; H1.17 43.32,44.08 v1(43.69,44.08)
RELAY3: length 61.3
  Top Layer w0.254: H1.18 46.99,45.21 46.99,55.24 47.75,56 47.75,62.6 v1(42.6,67.75) ; v1(23.05,68.52) 23.05,68.01 21.08,66.04 20.83,66.04 15.24,71.63 ESP32.13
  Bottom Layer w0.254: v1(42.6,67.75) 33.71,67.75 R7.2 29.9,68.52 26.35,68.52 26.1,68.26 23.3,68.26 v1(23.05,68.52)
RESET: length 26.5
  Top Layer w0.254: v1(24.38,41.4) 23.88,40.89 23.88,40.39 22.99,39.5 SPI.4 ; v1(36.58,48.01) 36.83,48.26 41.4,48.26 ESP32.17 ; v1(26.67,41.4) 28.19,41.4 29.46,42.67 H1.12 30.48,43.94 v1(31.24,43.94)
  Bottom Layer w0.254: v1(36.58,48.01) 35.56,48.01 34.29,46.74 34.29,46.23 33.02,44.96 32,44.96 31.24,44.2 v1(31.24,43.94) ; v1(26.67,41.4) v1(24.38,41.4)
RX: length 7.3
  Bottom Layer w0.254: ESP32.19 38.23,46.35 38.23,39.62 UART.2
SCK: length 42.5
  Top Layer w0.254: SPI.7 16.51,37.34 33.02,37.34 v1(33.53,37.85) ; 37.08,44.2 H1.15 ; 37.08,44.2 37.08,44.96 36.83,45.21 36.83,46.74 35.81,47.75 35.31,47.75 34.29,46.74 34.29,46.23 33.27,45.21 31.75,45.21 ESP32.22 ; 37.08,44.2 v1(37.34,44.2)
  Bottom Layer w0.254: v1(33.53,37.85) 36.07,37.85 36.58,38.35 36.58,43.43 v1(37.34,44.2)
SDA_MOSI: length 36.3
  Top Layer w0.254: 16.89,39.5 18.54,37.85 29.97,37.85 30.73,38.61 30.73,40.89 31.24,41.4 33.02,41.4 H1.14 36.07,41.4 39.88,41.4 40.89,42.42 40.89,43.43 v1(41.4,43.94)
  Bottom Layer w0.254: ESP32.16 43.94,44.7 42.16,44.7 v1(41.4,43.94)
TX: length 9.5
  Top Layer w0.254: ESP32.18 40.64,46.23 43.43,43.43 43.43,42.29 UART.3
VOLT_S: length 105
  Top Layer w0.254: v1(13.46,45.47) 13.82,45.82 13.82,51.92 20.07,58.17 20.07,62.23 27.69,69.85 30.99,69.85 ESP32.6 ; v1(35.56,17.02) 23.11,29.46 21.84,29.46 v1(21.34,29.97)
  Bottom Layer w0.254: v1(21.34,29.97) 19.3,32 17.78,32 13.21,36.58 13.21,41.4 H1.5 13.46,44.7 v1(13.46,45.47) ; Volsensror.2 54.86,3.56 52.58,3.56 51.56,2.54 49.53,2.54 35.56,16.51 v1(35.56,17.02)
VOUT_CURRENT: length 90.1
  Top Layer w0.254: v1(29.97,45.21) 30.99,45.21 32,44.2 v1(32.26,44.2)
  Bottom Layer w0.254: R12.1 25.39,61.23 29.21,57.4 29.21,45.97 v1(29.97,45.21)
  Bottom Layer w0.508: 57.53,2.92 57.42,2.81 57.42,1.77 58.15,1.03 68.58,1.03 68.69,1.14 68.96,1.14 Currentsensor.2 ; 57.53,2.92 43.62,16.83 43.3,16.83 42.25,17.89 42.25,18.21 32.38,28.07 32.38,29.93 32.35,29.96 32.35,39.25 32.38,39.28 32.38,41.28 33.4,42.29 33.4,42.36 33.34,42.43 33.34,43.43 33.4,43.49 33.4,43.56 32.64,44.32 32.38,44.32 v1(32.26,44.2)
$1N1884: length 33.5
  Top Layer w0.254: v1(26.49,59.24) 27,59.75 v1(27,63.81)
  Bottom Layer w0.254: Q5.3 30.99,40.01 29.21,41.78 28.96,41.78 28.19,42.55 28.19,44.58 26.74,46.03 26.74,58.98 v1(26.49,59.24) ; v1(27,63.81) R6.1
$1N2058: length 27.8
  Bottom Layer w0.254: 20.4,16.51 22.07,18.18 DIODE2.1 28.7,24.77 31.75,27.81 31.75,31.12 29.72,33.15 Q5.2
$1N2411: length 8.2
  Top Layer w0.254: PC2.2 30.1,30.86 27.69,30.86 23.88,34.67 Q2.2
$1N2413: length 34.4
  Top Layer w0.254: v1(20.83,47.62) 21.59,46.86 21.59,45.59 v1(20.57,44.58)
  Bottom Layer w0.254: v1(20.83,47.62) 20.07,48.39 20.07,65.54 R4.1 ; v1(20.57,44.58) 20.57,42.55 23.11,40.01 23.11,38.48 25.15,36.45 Q2.3
$1N2414: length 50.7
  Top Layer w0.254: v1(20.26,35.62) 27.69,28.19 PC2.1 ; v1(18.49,41.21) 21.79,41.21 v1(22.3,41.72)
  Bottom Layer w0.254: v1(22.3,41.72) 23.06,42.48 23.06,43.24 24.07,44.26 24.07,46.8 26.11,48.83 26.11,51.12 23.31,53.91 R5.1 ; v1(20.26,35.62) 18.23,37.65 18.23,40.96 v1(18.49,41.21)
$1N2420: length 42.2
  Top Layer w0.254: v1(22.61,51.44) 27.74,56.58 v1(27.74,64.2)
  Bottom Layer w0.254: v1(27.74,64.2) 27.74,65.47 R6.2 ; v1(22.61,51.44) 21.59,50.43 21.59,46.11 20.83,45.35 20.07,45.35 18.03,43.32 18.03,42.55 20.83,39.76 20.83,39 21.84,37.98 21.84,31.5 PC2.3
$1N2880: length 41
  Top Layer w0.254: v1(45.56,47.97) 45.56,54.57 47.34,56.35 47.34,58.58 42.26,63.66 v1(38.45,63.66) ; v1(46.58,40.6) 46.58,38.83 Q6.3
  Bottom Layer w0.254: v1(45.56,47.97) 45.82,47.97 46.84,46.95 46.84,45.94 46.07,45.18 46.07,41.11 v1(46.58,40.6) ; R9.1 38.45,65.44 v1(38.45,63.66)
$1N2883: length 51.1
  Top Layer w0.254: 32.87,27.65 32.1,26.89 v1(29.31,26.89) ; 32.87,27.65 32.87,25.65 DIODE3.1 ; 32.87,27.65 32.87,28.67 33.63,29.43 v1(36.93,29.43)
  Bottom Layer w0.254: RLY3.1 9.41,16.64 18.9,26.12 28.55,26.12 v1(29.31,26.89) ; Q6.2 41.5,33.49 37.44,29.43 v1(36.93,29.43)
$1N2886: length 8.1
  Top Layer w0.254: PC3.2 41.66,30.86 39.37,30.86 35.56,34.67 Q3.2
$1N2895: length 36.3
  Top Layer w0.254: Q3.3 36.83,35.43 v1(31.5,40.77)
  Bottom Layer w0.254: v1(31.5,40.77) 30.56,41.71 30.56,44.91 31.63,45.98 31.63,60.21 33.53,62.1 33.53,63.38 R7.1
$1N2896: length 51
  Top Layer w0.254: v1(35.12,62.17) v1(34.11,61.15)
  Bottom Layer w0.254: v1(34.11,61.15) 38.68,56.58 38.68,48.96 36.65,46.93 36.65,44.13 35.63,43.12 35.63,41.85 32.84,39.05 32.84,30.16 33.6,29.4 34.87,29.4 36.08,28.19 PC3.1 ; R8.1 35.12,65.21 v1(35.12,62.17)
$1N2898: length 39
  Top Layer w0.254: v1(38.41,37.02) v1(38.41,34.99)
  Bottom Layer w0.254: 38.41,34.98 PC3.3 ; R9.2 39.17,45.15 40.95,43.37 40.95,42.61 39.17,40.83 39.17,37.78 v1(38.41,37.02)
$1N3237: length 33
  Bottom Layer w0.254: R3.1 15.82,55.05 16.33,54.54 16.33,45.9 15.57,45.14 15.57,38.79 19.05,35.31 Q4.3
$1N3240: length 43.7
  Top Layer w0.254: DIODE1.1 13.21,24.64 17.78,29.21 17.78,29.72 17.27,30.23 17.27,32 ; 17.27,32 17.02,32.26 17.02,32.51 17.78,33.27 Q4.2 ; 17.27,32 23.11,32 29.46,25.65 29.46,24.38 37.21,16.64 RLY1.1
$1N3243: length 8.8
  Bottom Layer w0.254: 18.67,30.73 15.81,30.73 11.78,34.76 Q1.2
$1N3252: length 34.3
  Top Layer w0.254: Q1.3 13.05,35.27 11.28,37.05 v1(9.75,37.05)
  Bottom Layer w0.254: v1(9.75,37.05) 7.82,38.98 7.82,65.85 R1.1
$1N3253: length 46.7
  Top Layer w0.254: v1(17.09,29.53) 14.3,29.53 9.22,34.61 v1(9.22,36.39) ; v1(8.2,37.66) 8.2,38.93 10.23,40.96 v1(10.23,44.01)
  Bottom Layer w0.254: v1(10.23,44.01) 8.96,45.28 8.96,63.06 R2.1 ; 18.67,28.19 17.34,29.53 v1(17.09,29.53) ; v1(8.2,37.66) 8.2,37.4 v1(9.22,36.39)
$1N3255: length 41.3
  Bottom Layer w0.254: PC1.3 9.78,32 9.78,35.95 10.54,36.71 10.54,43.32 11.3,44.08 11.3,62.37 14.28,65.34 14.28,65.85 15.3,66.87 16.56,66.87 R3.2
$1N8641: length 8.8
  Top Layer w0.254: PC3.4 40.35,22.01 LED1.1
$1N8709: length 7.1
  Top Layer w0.254: LED2.1 23.33,22.09 23.33,27.47 PC2.4
$1N8745: length 9.2
  Top Layer w0.254: PC1.4 4.79,21.93 LED3.1
$1N8803: length 47.6
  Top Layer w0.254: LED4.1 v1(67.31,28.74)
  Bottom Layer w0.254: v1(67.31,28.74) 45.46,50.58 45.46,65.9 R10.2
$1N15345: length 2.2
  Bottom Layer w0.254: R13.2 32.7,62.76 R14.1
